# EAGLE design BigClown_Sensor_adapter_v0.2 (EAGLE 9.1.3)
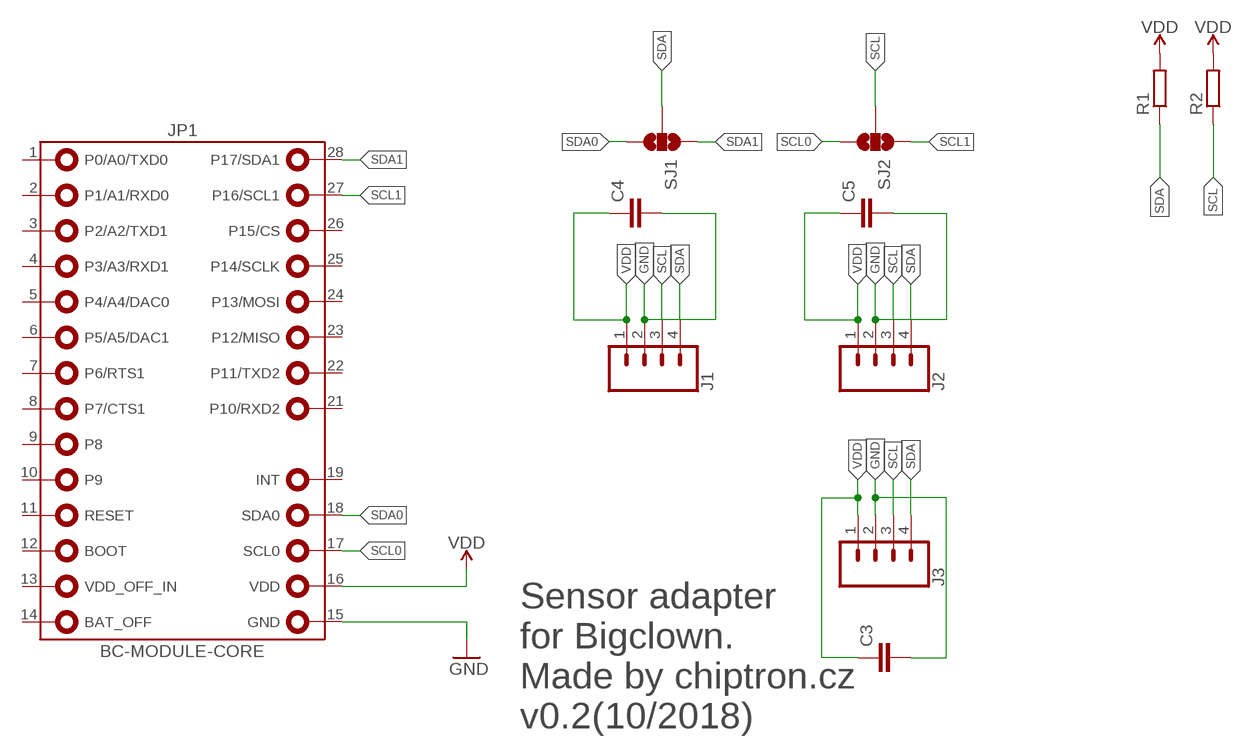
[diagram p0: schematic, sheet 1]

## Parts
C3  C-EUC0805  [C0805]
C4  C-EUC0805  [C0805]
C5  C-EUC0805  [C0805]
J1  CONN_04LONGPADS  [1X04_LONGPADS]
J2  CONN_04LONGPADS  [1X04_LONGPADS]
J3  CONN_04LONGPADS  [1X04_LONGPADS]
JP1  BC-MODULE-CORE  [BC-MODULE-CORE]
R1  R-EU_M0805  [M0805]
R2  R-EU_M0805  [M0805]
SJ1  SOLDERJUMPER_2WAYS  [SJ_3]
SJ2  SOLDERJUMPER_2WAYS  [SJ_3]

## Nets
GND: C3.2 C4.2 C5.2 J1.2 J2.2 J3.2 JP1.15(GND)
SCL: J1.3 J2.3 J3.3 R2.1 SJ2.2
SCL0: JP1.17(SCL0) SJ2.3
SCL1: JP1.27(P16/SCL1) SJ2.1
SDA: J1.4 J2.4 J3.4 R1.1 SJ1.2
SDA0: JP1.18(SDA0) SJ1.3
SDA1: JP1.28(P17/SDA1) SJ1.1
VDD: C3.1 C4.1 C5.1 J1.1 J2.1 J3.1 JP1.16(VDD) R1.2 R2.2
Unconnected: JP1.1(P0/A0/TXD0) JP1.2(P1/A1/RXD0) JP1.3(P2/A2/TXD1) JP1.4(P3/A3/RXD1) JP1.5(P4/A4/DAC0) JP1.6(P5/A5/DAC1) JP1.7(P6/RTS1) JP1.8(P7/CTS1) JP1.9(P8) JP1.10(P9) JP1.11(RESET) JP1.12(BOOT) JP1.13(VDD_OFF_IN) JP1.14(BAT_OFF) JP1.19(INT) JP1.21(P10/RXD2) JP1.22(P11/TXD2) JP1.23(P12/MISO) JP1.24(P13/MOSI) JP1.25(P14/SCLK) JP1.26(P15/CS)

## Notes on the sheet
- Sensor adapter 
  for Bigclown.
  Made by chiptron.cz
  v0.2(10/2018)

## Library data of the parts
C3-C5 = rcl:C-EU: CAPACITOR, European symbol; SPICEPREFIX: C
J1-J3 = SparkFun-Connectors:CONN_04: Multi connection point. Often used as Generic Header-pin footprint for 0.1 inch spaced/style header connections On any of the 0.1 inch spaced packages, you can populate with these: Break Away Headers - Straight <https://www.sparkfun.com/products/116> (PRT-00116) Break Away Male Headers - Right Angle <https://www.sparkfun.com/products/553> (PRT-00553) Female Headers <https://www.sparkfun.com/products/115> (PRT-00115) Break Away Headers - Machine Pin <https://www.sparkfun.com/products/117> (PRT-00117) Break Away Female Headers - Swiss Machine Pin <https://www.sparkfun.com/products/743> (PRT-00743) For SCREWTERMINALS and SPRING TERMINALS visit here: Screw Terimnals on SparkFun.com <https://www.sparkfun.com/search/results?term=Screw+Terminals> (5mm/3.5mm/2.54mm spacing) This device is also useful as a general connection point to wire up your design to another part of your project. Our various solder wires solder well into these plated through hole pads. Hook-Up Wire - Assortment (Stranded, 22 AWG) <https://www.sparkfun.com/products/11375> (PRT-11375) Hook-Up Wire - Assortment (Solid Core, 22 AWG) <https://www.sparkfun.com/products/11367> (PRT-11367) View the entire wire category on our website here <https://www.sparkfun.com/categories/141> Special notes: Molex polarized connector foot print use with SKU : PRT-08231 with associated crimp pins and housings. 1MM SMD Version SKU: PRT-10208; PROD_ID: CONN-09696
JP1 = bigclown:BC-MODULE-CORE: BigClown Core Module Follow this link <https://shop.bigclown.com/products/core-module> for more information.
R1 R2 = rcl:R-EU_: RESISTOR, European symbol; SPICEPREFIX: R
SJ1 SJ2 = SparkFun:SOLDERJUMPER_2WAY: Solder Jumper 2 way solder jumper

## Board
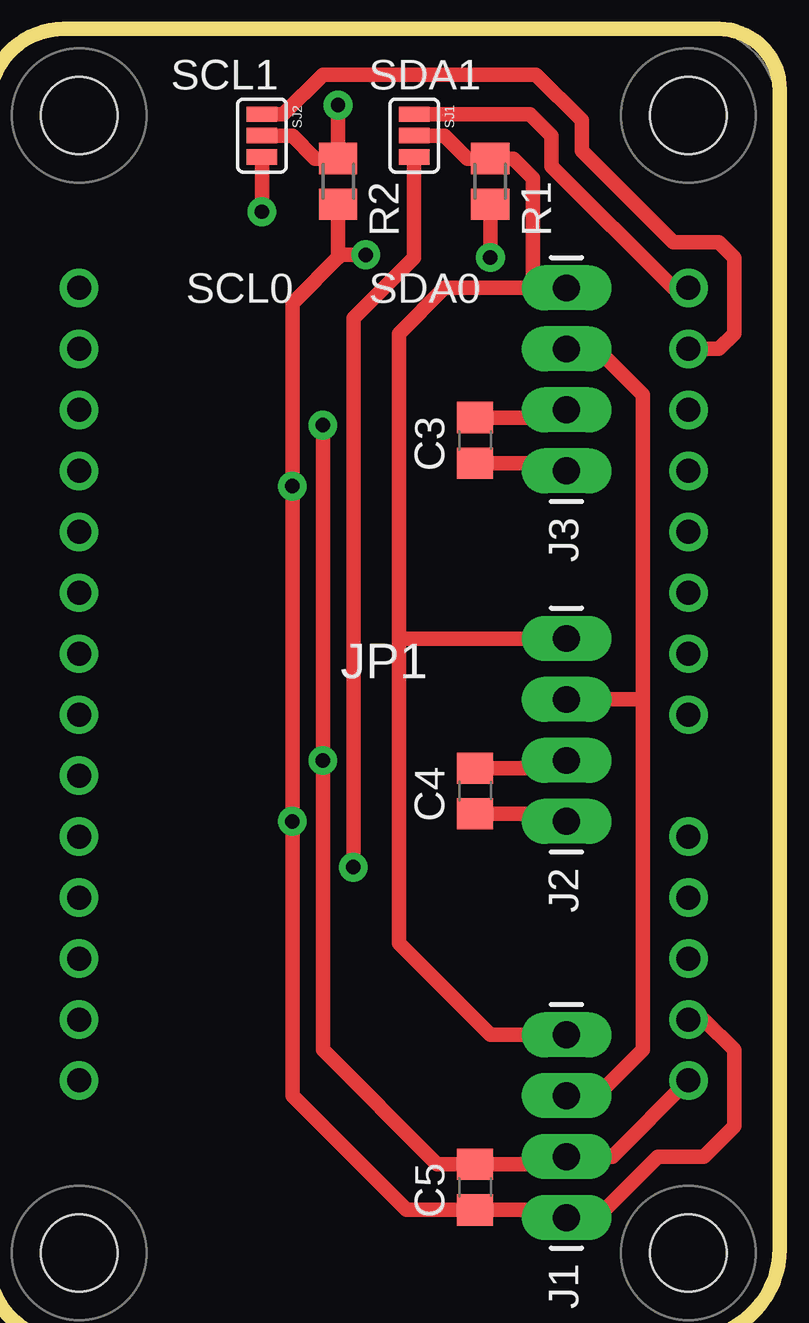
[diagram p1: board, top side]
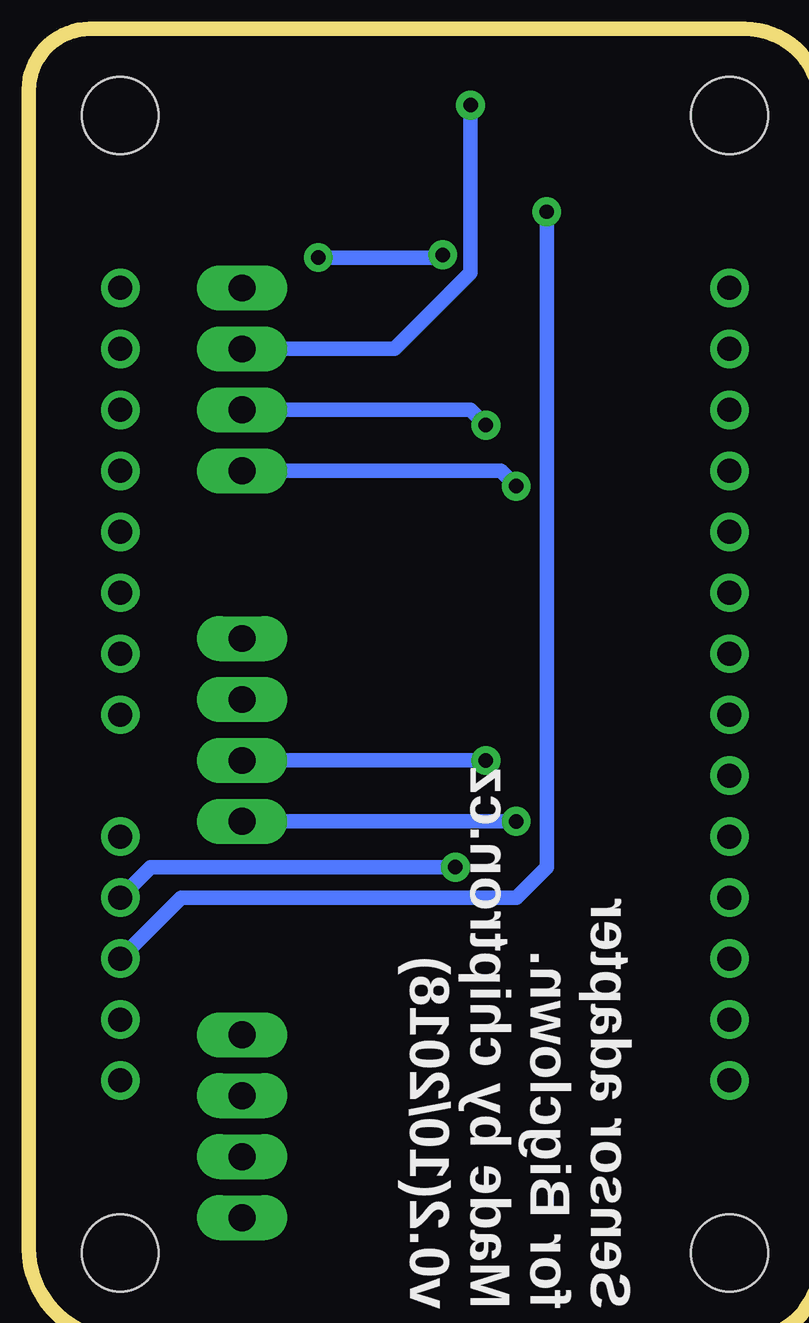
[diagram p2: board, bottom side, seen from below]

No outline drawn. Coordinates in mm, seen from the top.
Copper layers (1*16): Top 0.035mm / dielectric 1.5mm / Bottom 0.035mm
Design rules "default": minimum track width 6mil, minimum drill 0.35mm, track to track 6mil, track to pad 6mil, pad to pad 6mil, via to via 6mil, smd to smd 6mil, copper to edge 40mil, drill to drill 6mil, minimum pad ring 10mil, minimum via ring 8mil, stop-mask expansion 4mil, vias tented up to drill 0mil, thermal gap 10mil
Milling: 8 lines

### Footprints (pad centres in the part's own frame; a part is rotated, then mirrored left to right if it is on the bottom)
C0805 = smd 1.3 x 1.5: 1 -0.95,0; 2 0.95,0
1X04_LONGPADS = drill 1.118 pad 1.88 long: 1 0,0; 2 2.54,0; 3 5.08,0; 4 7.62,0
BC-MODULE-CORE = drill 1 pad 1.6: 1 -12.7,16.51; 2 -12.7,13.97; 3 -12.7,11.43; 4 -12.7,8.89; 5 -12.7,6.35; 6 -12.7,3.81; 7 -12.7,1.27; 8 -12.7,-1.27; 9 -12.7,-3.81; 10 -12.7,-6.35; 11 -12.7,-8.89; 12 -12.7,-11.43; 13 -12.7,-13.97; 14 -12.7,-16.51; 15 12.7,-16.51; 16 12.7,-13.97; 17 12.7,-11.43; 18 12.7,-8.89; 19 12.7,-6.35; 21 12.7,-1.27; 22 12.7,1.27; 23 12.7,3.81; 24 12.7,6.35; 25 12.7,8.89; 26 12.7,11.43; 27 12.7,13.97; 28 12.7,16.51 | hole 3.2: -12.7,23.7; 12.7,23.7; -12.7,-23.7; 12.7,-23.7
M0805 = smd 1.3 x 1.6: 1 -0.95,0; 2 0.95,0
SJ_3 = smd 0.635 x 1.27: 1 -0.889,0; 2 0,0; 3 0.889,0

### Placement (x,y rotation side)
C3  22.86,40.64 90 top
C4  22.86,26.04 90 top
C5  22.86,9.53 90 top
J1  26.67,8.26 90 top
J2  26.67,24.77 90 top
J3  26.67,39.37 90 top
JP1  19.05,30.48 0 top
R1  23.5,51.44 270 top
R2  17.14,51.44 270 top
SJ1  20.32,53.34 270 top
SJ2  13.97,53.34 270 top

### Tracks (layer width: path | path; a pad name or v marks a point on that pad's centre or on a via)
GND  (via drill 0.6 pad 1.2)
  Top 0.61: J3.2 26.35,41.59 C3.2 | C4.2 26.35,26.98 J2.2 | v16.51,41.27 v16.51,27.3 16.51,15.24 21.27,10.47 C5.2 26.35,10.47 J1.2 28.57,10.79 JP1.15
  Bottom 0.61: J3.2 17.14,41.91 v16.51,41.27 | J2.2 v16.51,27.3
SCL  (via drill 0.6 pad 1.2)
  Top 0.61: J3.3 27.94,44.45 29.84,42.55 29.84,29.84 | 29.84,29.84 29.84,15.24 27.94,13.34 J1.3 | 17.14,52.7 R2.1 | R2.1 v17.14,54.61 | SJ2.2 15.24,53.34 16.2,52.38 R2.1 | J2.3 29.84,29.84
  Bottom 0.61: v17.14,54.61 17.14,47.62 20.32,44.45 J3.3
SCL0  (via drill 0.6 pad 1.2)
  Top 0.61: v13.97,50.16 SJ2.3
  Bottom 0.61: JP1.17 29.21,21.59 15.24,21.59 13.97,22.86 v13.97,50.16
SCL1
  Top 0.61: SJ2.1 14.86,54.23 16.51,55.88 25.4,55.88 27.3,53.98 27.3,52.7 31.11,48.9 33.02,48.9 33.66,48.26 33.66,45.09 33.02,44.45 JP1.27
SDA
  Top 0.61: 23.5,52.7 R1.1 | J3.4 25.27,46.99 | 25.27,46.99 21.59,46.99 19.68,45.09 19.68,32.38 | 19.68,32.38 19.68,19.68 23.5,15.88 J1.4 | J2.4 19.68,32.38 | R1.1 24.45,52.38 25.27,51.56 25.27,46.99 | SJ1.2 21.59,53.34 22.55,52.38 R1.1
SDA0  (via drill 0.6 pad 1.2)
  Top 0.61: SJ1.3 20.32,48.26 17.78,45.72 v17.78,22.86
  Bottom 0.61: JP1.18 30.48,22.86 v17.78,22.86
SDA1
  Top 0.61: SJ1.1 25.15,54.23 26.04,53.34 26.04,52.07 31.11,46.99 JP1.28
VDD  (via drill 0.6 pad 1.2)
  Top 0.61: C3.1 26.35,39.69 J3.1 | C4.1 26.35,25.09 J2.1 | 17.26,48.37 17.14,48.26 R2.2 | JP1.16 32.38,16.51 33.66,15.24 33.66,12.06 32.38,10.79 30.48,10.79 27.94,8.26 J1.1 26.35,8.57 C5.1 20,8.57 15.24,13.34 v15.24,24.77 v15.24,38.73 15.24,46.35 17.26,48.37 | R1.2 v23.5,48.26 | v18.3,48.37 17.26,48.37
  Bottom 0.61: J2.1 v15.24,24.77 | J3.1 15.88,39.37 v15.24,38.73 | v23.5,48.26 18.41,48.26 v18.3,48.37

### Text on the board
tNames: SCL1 | SDA1 | SCL0 | SDA0
bNames: Sensor adapter / for Bigclown. / Made by chiptron.cz / v0.2(10/2018)